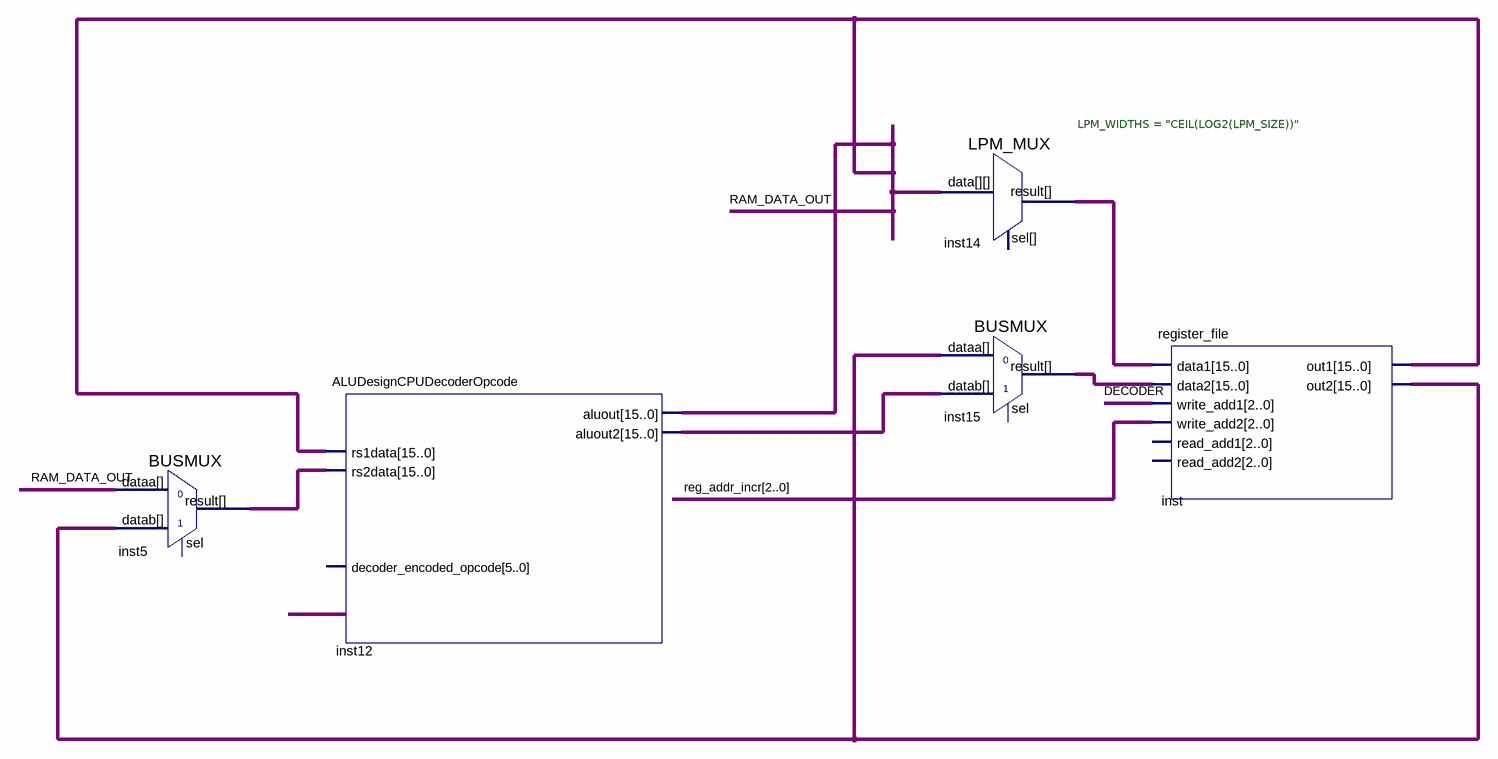
[diagram p0: schematic sheet]
// Quartus schematic alu-regfile.bdf as structural Verilog: 5 symbols, 0 pins
module \alu-regfile  (
);

  wire DECODER, RAM_DATA_OUT;
  wire [2:0] reg_addr_incr;
  wire [15:0] inst5_result, inst12_aluout2, inst14_result, inst15_result, inst_out2;

  BUSMUX inst5 (.datab(inst_out2), .dataa(RAM_DATA_OUT), .result(inst5_result));  // open: sel
  ALUDesignCPUDecoderOpcode inst12 (
    .rs1data({16{RAM_DATA_OUT}}), .rs2data(inst5_result), .aluout2(inst12_aluout2), .aluout(RAM_DATA_OUT));  // open: decoder_encoded_opcode
  LPM_MUX #(.LPM_WIDTHS("CEIL(LOG2(LPM_SIZE))")) inst14 (.data(RAM_DATA_OUT), .result(inst14_result));  // open: sel
  BUSMUX inst15 (.datab(inst12_aluout2), .dataa(inst_out2), .result(inst15_result));  // open: sel
  register_file inst (
    .data1(inst14_result), .data2(inst15_result), .write_add1({3{DECODER}}), .write_add2(reg_addr_incr),
    .out1(RAM_DATA_OUT), .out2(inst_out2));  // open: read_add1, read_add2
endmodule
